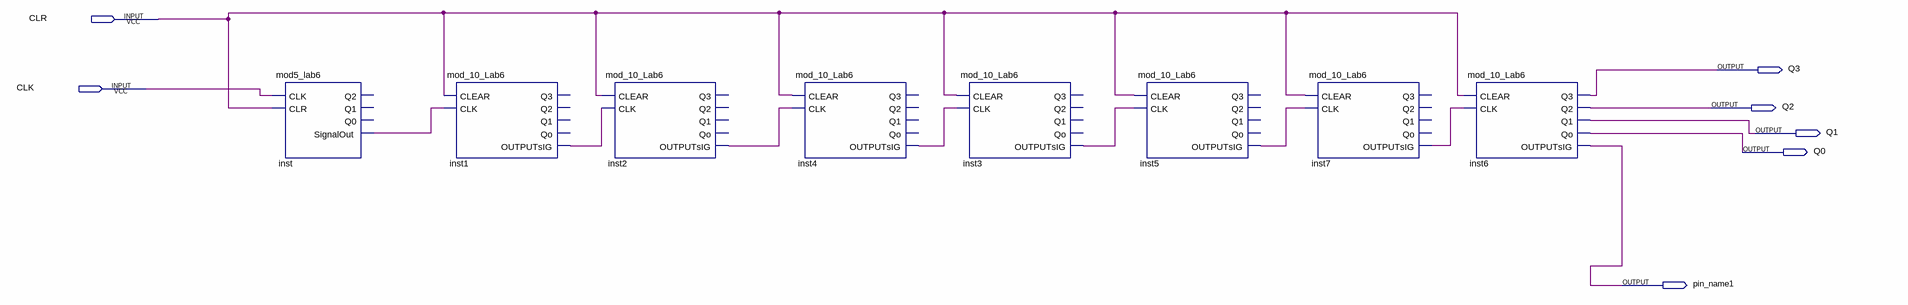
[diagram p0: schematic sheet]
// Quartus schematic FreqDivider.bdf as structural Verilog: 8 symbols, 7 pins
module FreqDivider (
  input  CLR,
  input  CLK,
  output Q3,
  output Q2,
  output Q1,
  output Q0,
  output pin_name1
);

  wire inst1_outputsig, inst2_outputsig, inst3_outputsig, inst4_outputsig, inst5_outputsig, inst7_outputsig,
       inst_signalout;

  mod5_lab6 inst (.CLK(CLK), .CLR(CLR), .SignalOut(inst_signalout));  // open: Q2, Q1, Q0
  mod_10_Lab6 inst1 (.CLEAR(CLR), .CLK(inst_signalout), .OUTPUTsIG(inst1_outputsig));  // open: Q3, Q2, Q1, Qo
  mod_10_Lab6 inst2 (.CLEAR(CLR), .CLK(inst1_outputsig), .OUTPUTsIG(inst2_outputsig));  // open: Q3, Q2, Q1, Qo
  mod_10_Lab6 inst4 (.CLEAR(CLR), .CLK(inst2_outputsig), .OUTPUTsIG(inst4_outputsig));  // open: Q3, Q2, Q1, Qo
  mod_10_Lab6 inst3 (.CLEAR(CLR), .CLK(inst4_outputsig), .OUTPUTsIG(inst3_outputsig));  // open: Q3, Q2, Q1, Qo
  mod_10_Lab6 inst5 (.CLEAR(CLR), .CLK(inst3_outputsig), .OUTPUTsIG(inst5_outputsig));  // open: Q3, Q2, Q1, Qo
  mod_10_Lab6 inst7 (.CLEAR(CLR), .CLK(inst5_outputsig), .OUTPUTsIG(inst7_outputsig));  // open: Q3, Q2, Q1, Qo
  mod_10_Lab6 inst6 (.CLEAR(CLR), .CLK(inst7_outputsig), .Q3(Q3), .Q2(Q2), .Q1(Q1), .Qo(Q0), .OUTPUTsIG(pin_name1));
endmodule
